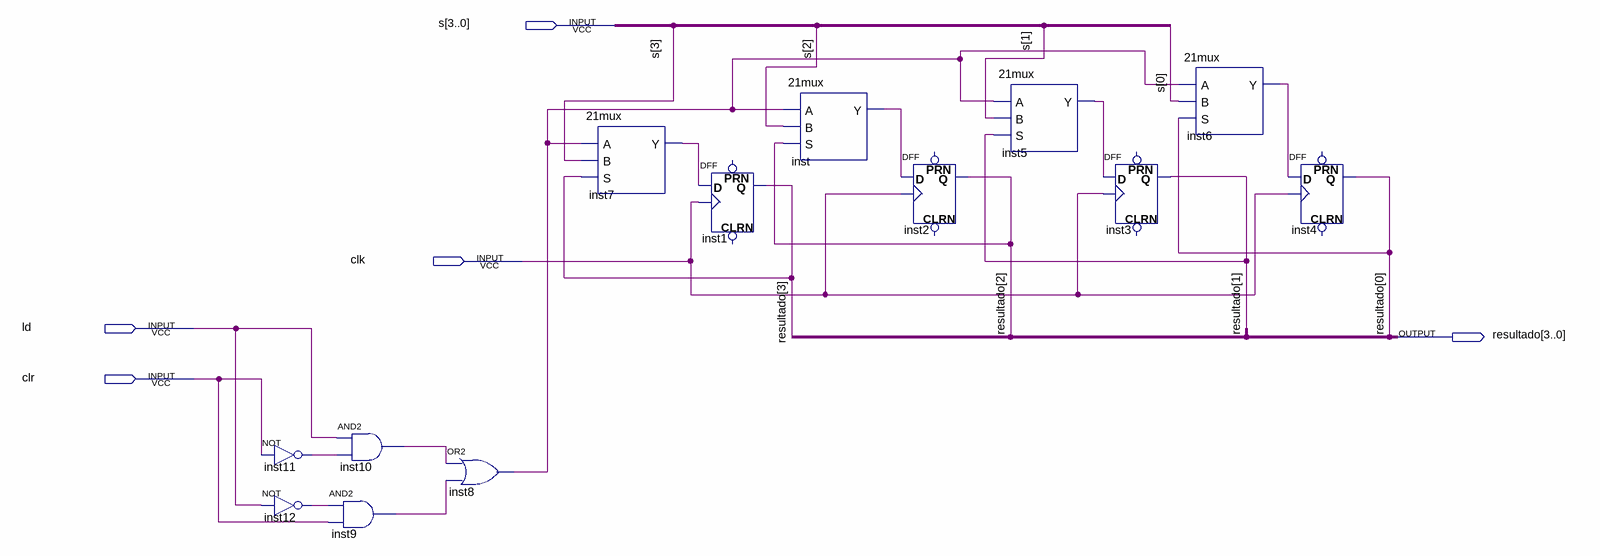
[diagram p0: schematic sheet]
// Quartus schematic I.bdf as structural Verilog: 13 symbols, 5 pins
module I (
  input  [3:0] s,
  input  clk,
  input  ld,
  input  clr,
  output [3:0] resultado
);

  wire inst5_y, inst6_y, inst7_y, inst8_out, inst9_out, inst10_out, inst11_out, inst12_out, inst_y;

  not inst11 (inst11_out, clr);
  not inst12 (inst12_out, ld);
  and inst10 (inst10_out, ld, inst11_out);
  and inst9 (inst9_out, inst12_out, clr);
  or inst8 (inst8_out, inst10_out, inst9_out);
  \21mux  inst7 (.A(inst8_out), .B(s[3]), .S(resultado[3]), .Y(inst7_y));
  DFF inst1 (.CLK(clk), .D(inst7_y), .Q(resultado[3]));  // open: CLRN, PRN
  \21mux  inst (.A(inst8_out), .B(s[2]), .S(resultado[2]), .Y(inst_y));
  DFF inst2 (.CLK(clk), .D(inst_y), .Q(resultado[2]));  // open: CLRN, PRN
  \21mux  inst5 (.A(inst8_out), .B(s[1]), .S(resultado[1]), .Y(inst5_y));
  DFF inst3 (.CLK(clk), .D(inst5_y), .Q(resultado[1]));  // open: CLRN, PRN
  \21mux  inst6 (.A(inst8_out), .B(s[0]), .S(resultado[0]), .Y(inst6_y));
  DFF inst4 (.CLK(clk), .D(inst6_y), .Q(resultado[0]));  // open: CLRN, PRN
endmodule
